# EAGLE design BridgerSoc (EAGLE 6.4)

## Sheet 1 of 4
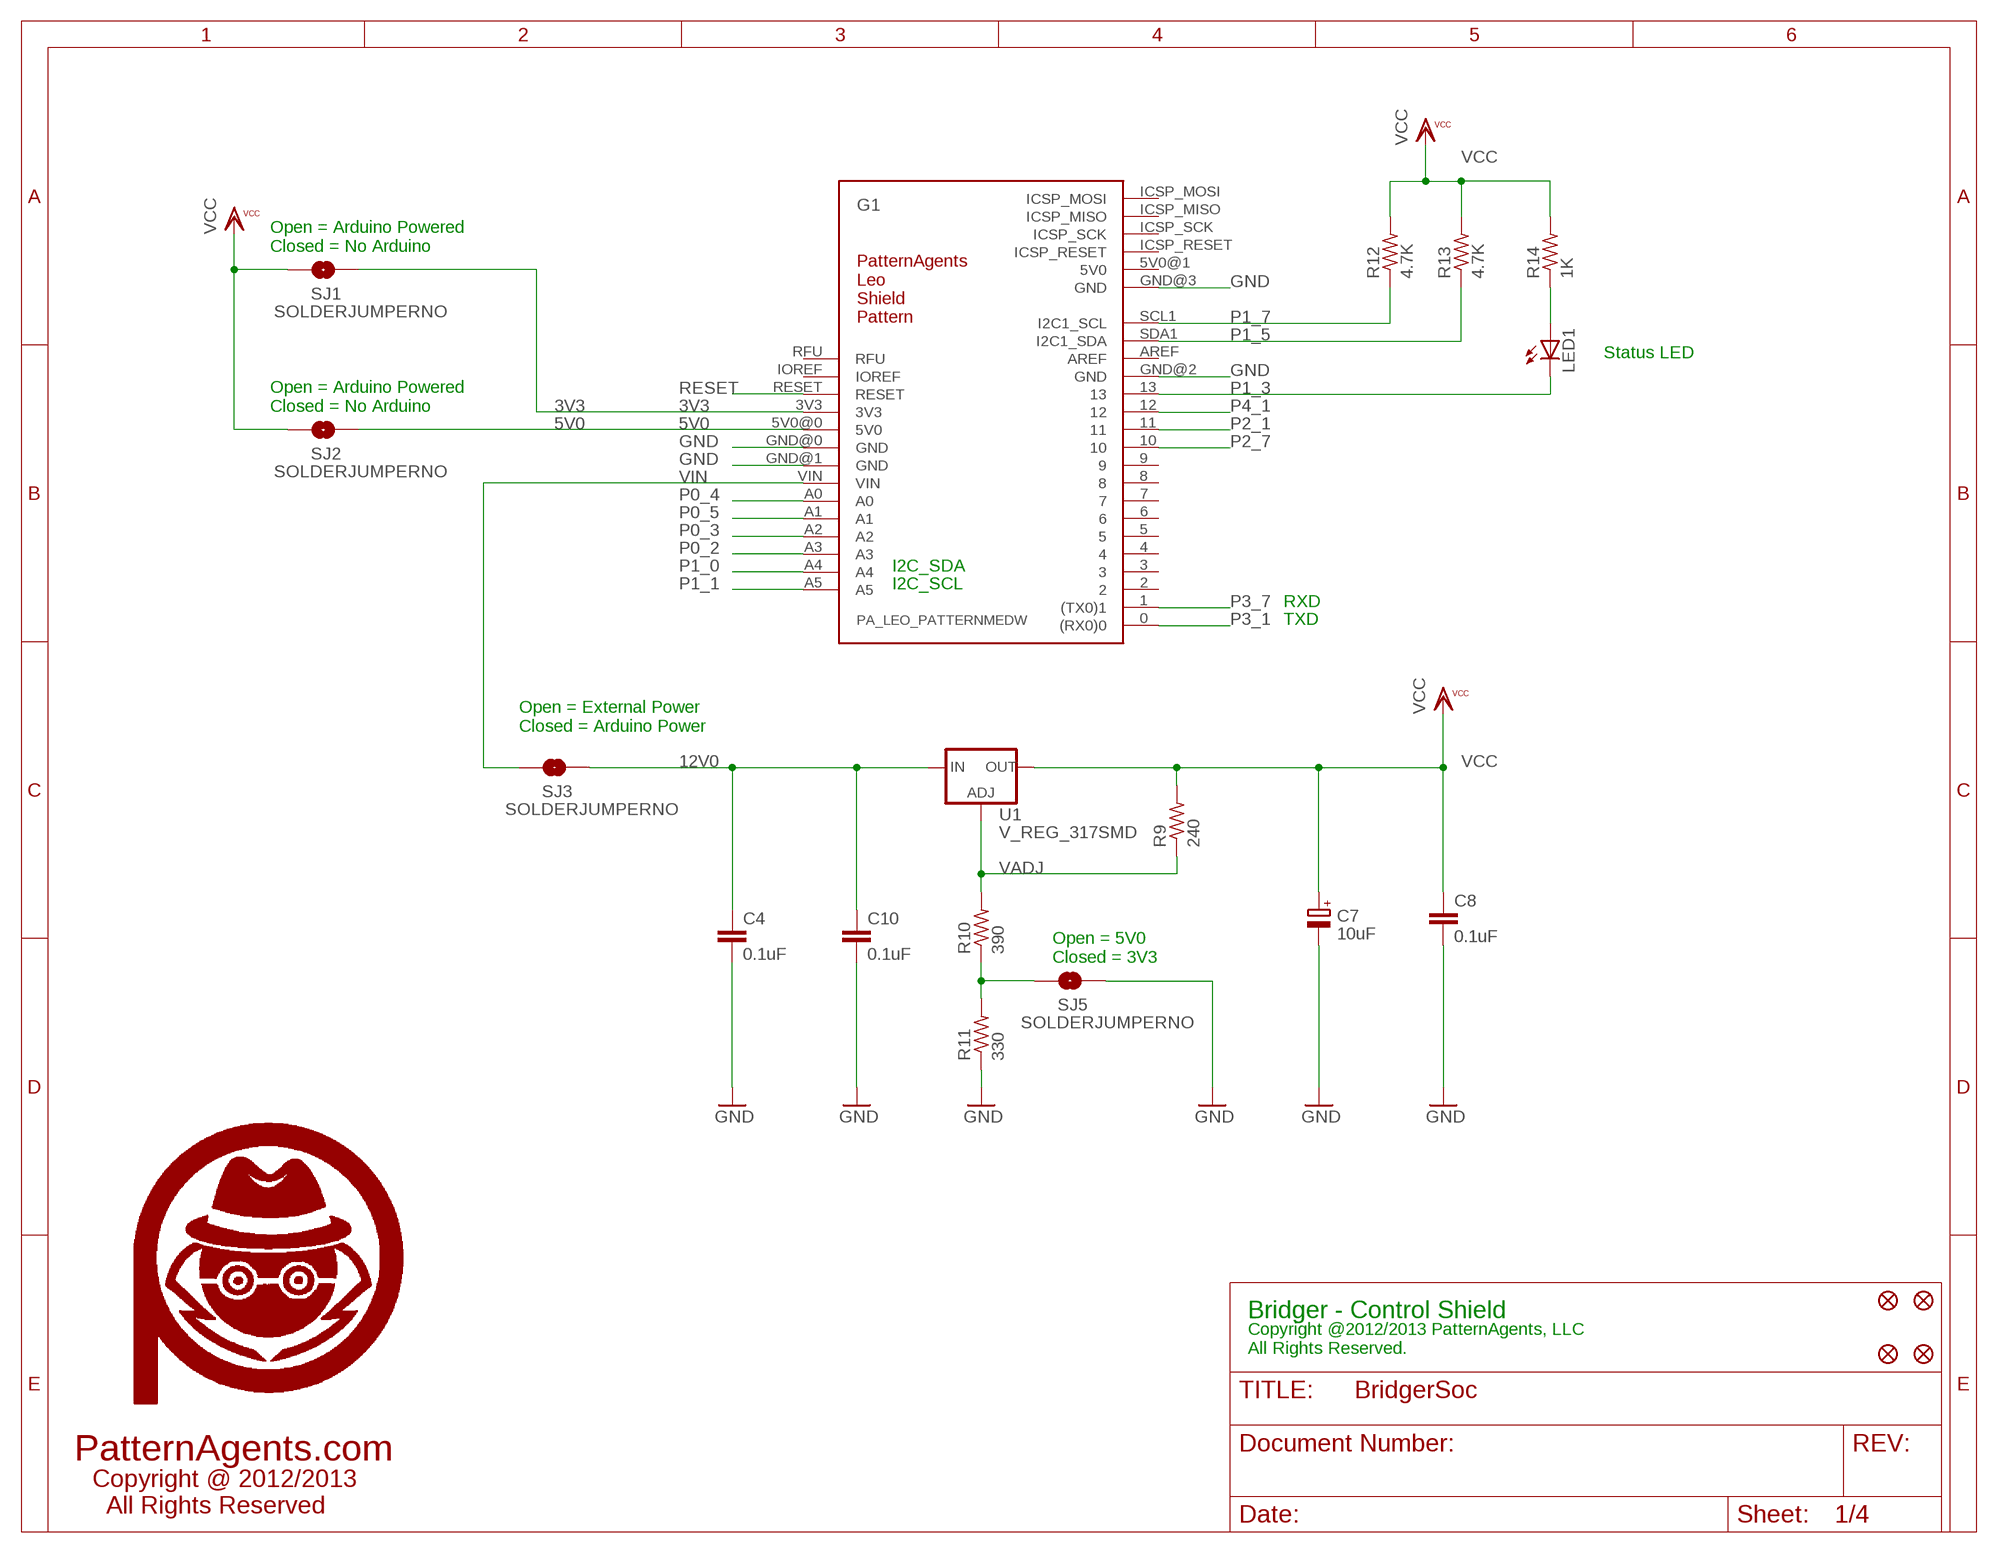
[diagram p0: schematic, sheet 1]

### Parts
C4  0.1uF  CAP0603-CAP  [0603-CAP]
C7  10uF  CPOL-EUSMCB  [SMC_B]
C8  0.1uF  CAP0603-CAP  [0603-CAP]
C10  0.1uF  CAP0603-CAP  [0603-CAP]
FID1  FIDUCIAL1.5X3  [FIDUCIAL-1.5X3]
FID2  FIDUCIAL1.5X3  [FIDUCIAL-1.5X3]
FID3  FIDUCIAL1.5X3  [FIDUCIAL-1.5X3]
FID4  FIDUCIAL1.5X3  [FIDUCIAL-1.5X3]
G1  PA_LEO_PATTERNMEDW  [PA_LEO_MEDW_PATTERN]
LED1  LED0603  [LED-0603]
R9  240  RESISTORR0603  [R0603]
R10  390  RESISTORR0603  [R0603]
R11  330  RESISTORR0603  [R0603]
R12  4.7K  RESISTORR0603  [R0603]
R13  4.7K  RESISTORR0603  [R0603]
R14  1K  RESISTORR0603  [R0603]
SJ1  SOLDERJUMPERNO  [SJ_2S-NO]
SJ2  SOLDERJUMPERNO  [SJ_2S-NO]
SJ3  SOLDERJUMPERNO  [SJ_2S-NO]
SJ5  SOLDERJUMPERNO  [SJ_2S-NO]
U1  V_REG_317SMD  [SOT223]
U$1  PA_LOGO_SYMLARGE  [PA_LOGO_AGENT_LRG_SYM]

### Nets
3V3: G1.3V3 SJ1.1
5V0: G1.5V0@0(5V0) SJ2.1
12V0: C4.1 C10.1 SJ3.1 U1.3(IN) ; also sheet 3
GND: C4.2 C7.- C8.2 C10.2 G1.GND@0(GND) G1.GND@1(GND) G1.GND@2(GND) G1.GND@3(GND) R11.1 SJ5.1 ; also sheet 2,3,4
LED_D13: LED1.A R14.1
P0_2: G1.A3 ; also sheet 2
P0_3: G1.A2 ; also sheet 2
P0_4: G1.A0 ; also sheet 2
P0_5: G1.A1 ; also sheet 2
P1_0: G1.A4 ; also sheet 2
P1_1: G1.A5 ; also sheet 2
P1_3: G1.13 LED1.C ; also sheet 2
P1_5: G1.SDA1(I2C1_SDA) R13.1 ; also sheet 2
P1_7: G1.SCL1(I2C1_SCL) R12.1 ; also sheet 2
P2_1: G1.11 ; also sheet 2
P2_7: G1.10 ; also sheet 2
P3_1: G1.0((RX0)0) ; also sheet 2
P3_7: G1.1((TX0)1) ; also sheet 2
P4_1: G1.12 ; also sheet 2
RESET: G1.RESET
V3_5: R10.1 R11.2 SJ5.2
VADJ: R9.1 R10.2 U1.1(ADJ)
VCC: C7.+ C8.1 R9.2 R12.2 R13.2 R14.2 SJ1.2 SJ2.2 U1.2(OUT) ; also sheet 2,3,4
VIN: G1.VIN SJ3.2
Unconnected: G1.2 G1.3 G1.4 G1.5 G1.6 G1.7 G1.8 G1.9 G1.AREF G1.ICSP_MISO G1.ICSP_MOSI G1.ICSP_RESET G1.ICSP_SCK G1.IOREF

### Notes on the sheet
- Open = Arduino Powered
  Closed = No Arduino
- Status LED
- Open = Arduino Powered
  Closed = No Arduino
- I2C_SDA
- I2C_SCL
- RXD
- TXD
- Open = External Power
  Closed = Arduino Power
- Open = 5V0
  Closed = 3V3
- Bridger - Control Shield
- Copyright @2012/2013 PatternAgents, LLC
  All Rights Reserved.
- PatternAgents.com
- Copyright @ 2012/2013
    All Rights Reserved

## Sheet 2 of 4
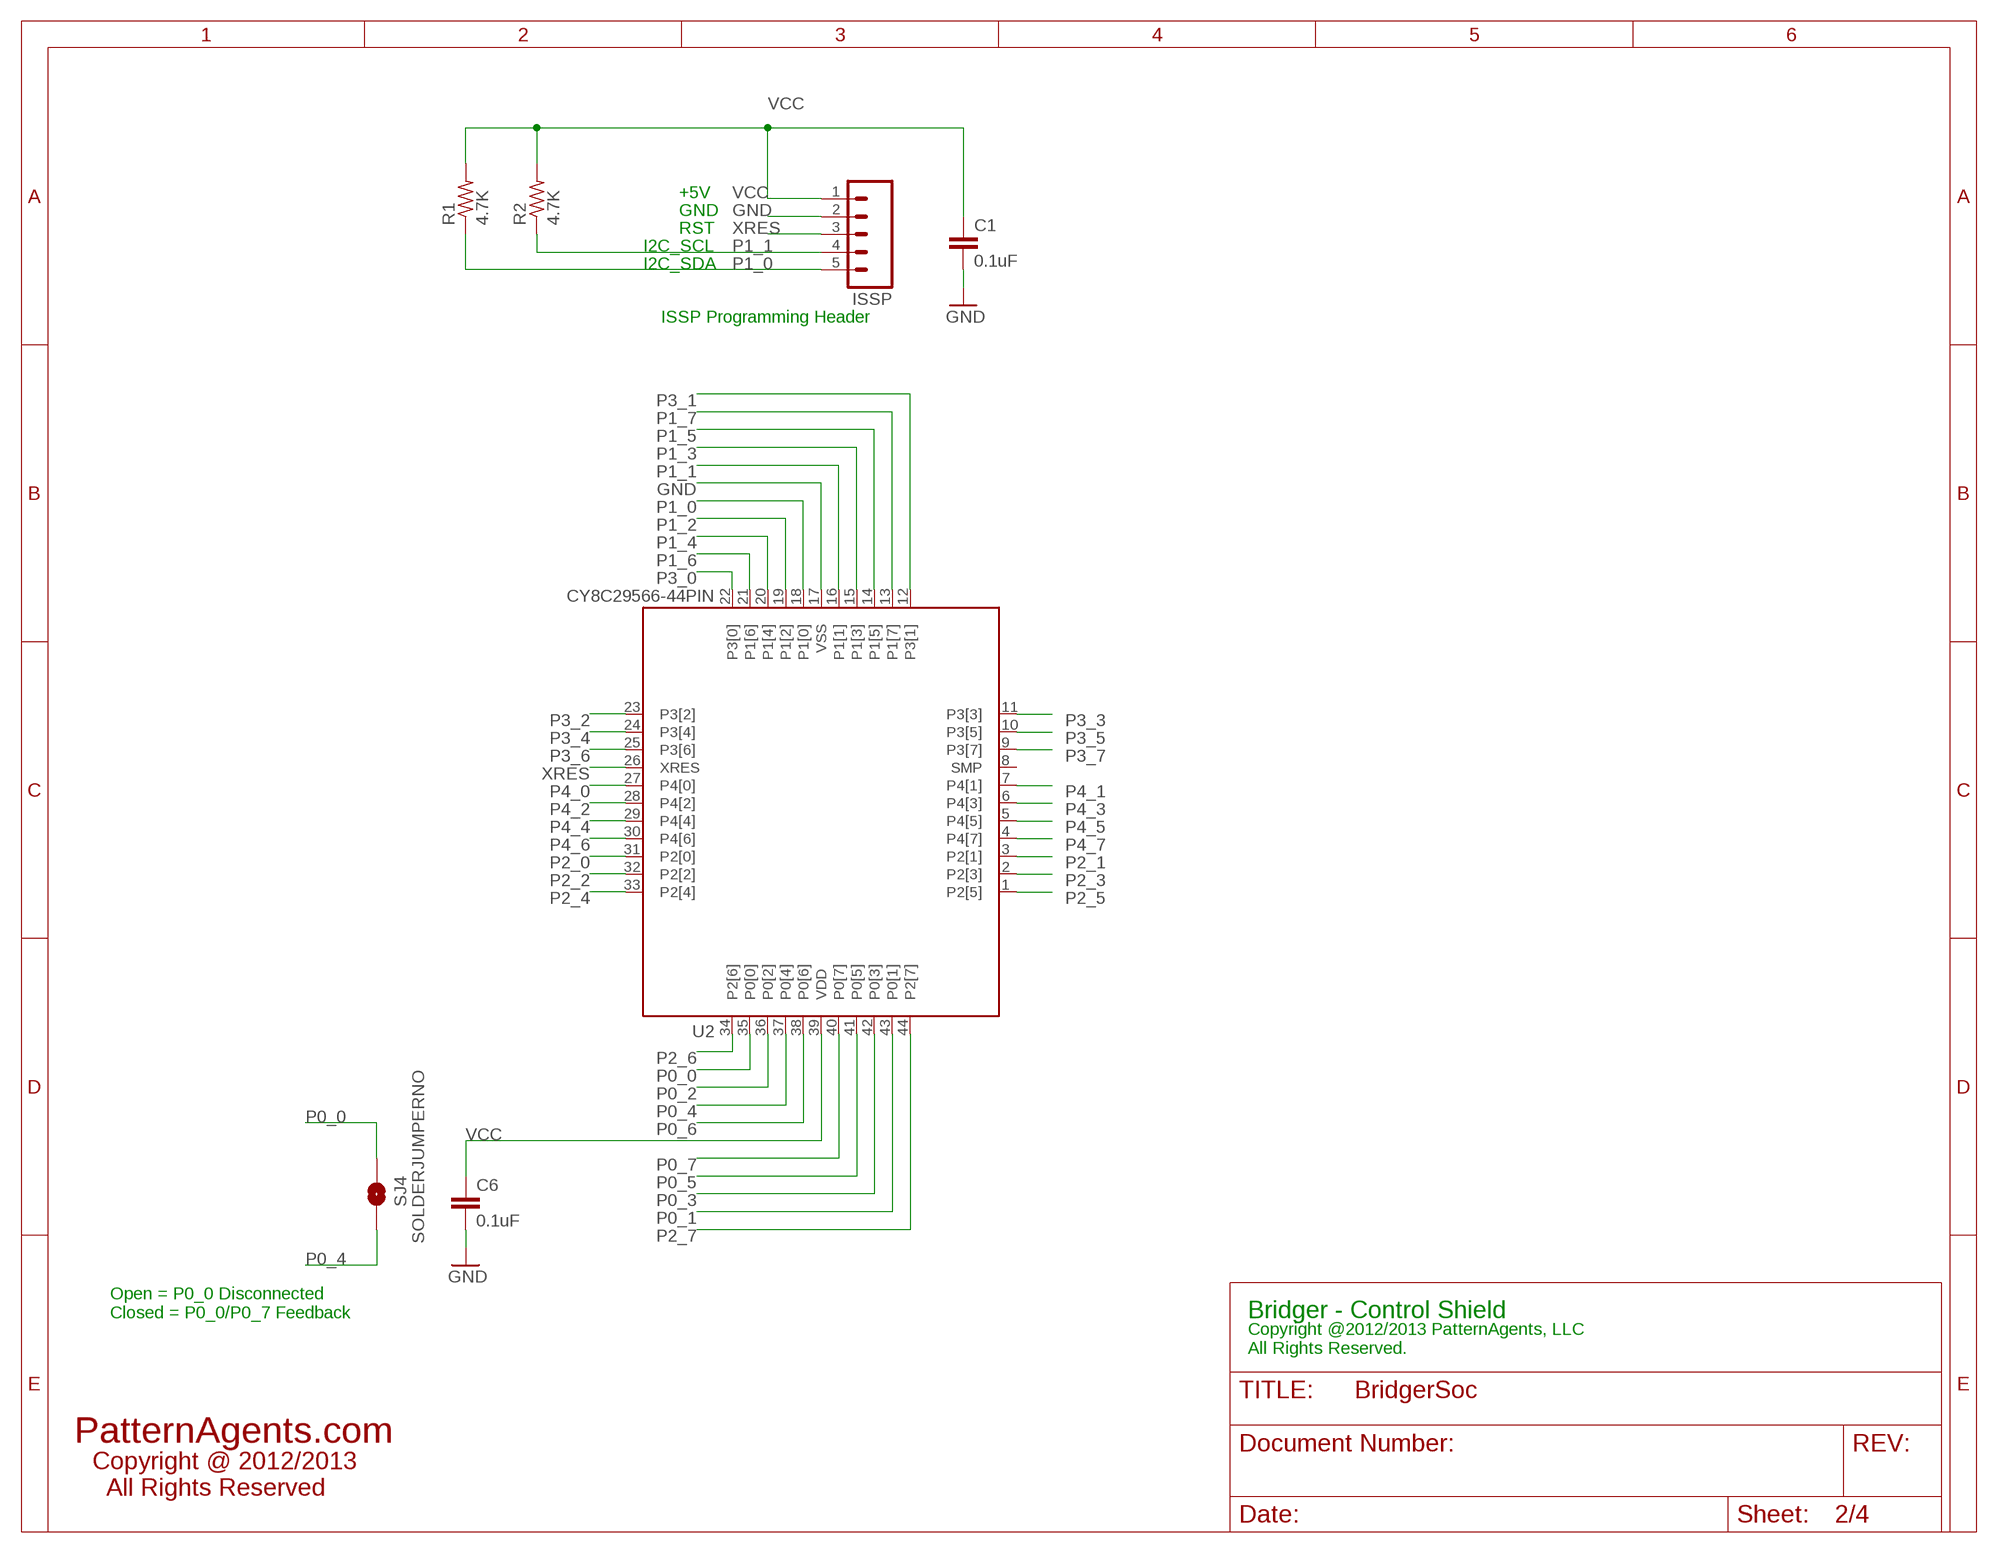
[diagram p1: schematic, sheet 2]

### Parts
C1  0.1uF  CAP0603-CAP  [0603-CAP]
C6  0.1uF  CAP0603-CAP  [0603-CAP]
ISSP  M05PTH  [1X05]
R1  4.7K  RESISTORR0603  [R0603]
R2  4.7K  RESISTORR0603  [R0603]
SJ4  SOLDERJUMPERNO  [SJ_2S-NO]
U2  CY8C29566-44PIN  [TQFP-10X10-44]

### Nets
GND: C1.2 C6.2 ISSP.2 U2.17(VSS) ; also sheet 1,3,4
P0_0: SJ4.1 U2.35(P0[0])
P0_1: U2.43(P0[1]) ; also sheet 3
P0_2: U2.36(P0[2]) ; also sheet 1
P0_3: U2.42(P0[3]) ; also sheet 1
P0_4: SJ4.2 U2.37(P0[4]) ; also sheet 1
P0_5: U2.41(P0[5]) ; also sheet 1
P0_6: U2.38(P0[6]) ; also sheet 3
P0_7: U2.40(P0[7]) ; also sheet 3
P1_0: ISSP.5 R1.1 U2.18(P1[0]) ; also sheet 1
P1_1: ISSP.4 R2.1 U2.16(P1[1]) ; also sheet 1
P1_2: U2.19(P1[2]) ; also sheet 3
P1_3: U2.15(P1[3]) ; also sheet 1
P1_4: U2.20(P1[4]) ; also sheet 3
P1_5: U2.14(P1[5]) ; also sheet 1
P1_6: U2.21(P1[6]) ; also sheet 3
P1_7: U2.13(P1[7]) ; also sheet 1
P2_0: U2.31(P2[0]) ; also sheet 3
P2_1: U2.3(P2[1]) ; also sheet 1
P2_2: U2.32(P2[2]) ; also sheet 3
P2_3: U2.2(P2[3]) ; also sheet 3
P2_4: U2.33(P2[4]) ; also sheet 3
P2_5: U2.1(P2[5]) ; also sheet 3
P2_6: U2.34(P2[6]) ; also sheet 4
P2_7: U2.44(P2[7]) ; also sheet 1
P3_0: U2.22(P3[0]) ; also sheet 3
P3_1: U2.12(P3[1]) ; also sheet 1
P3_2: U2.23(P3[2]) ; also sheet 4
P3_3: U2.11(P3[3]) ; also sheet 3
P3_4: U2.24(P3[4]) ; also sheet 4
P3_5: U2.10(P3[5]) ; also sheet 3
P3_6: U2.25(P3[6]) ; also sheet 3
P3_7: U2.9(P3[7]) ; also sheet 1
P4_0: U2.27(P4[0]) ; also sheet 3
P4_1: U2.7(P4[1]) ; also sheet 1
P4_2: U2.28(P4[2]) ; also sheet 3
P4_3: U2.6(P4[3]) ; also sheet 4
P4_4: U2.29(P4[4]) ; also sheet 3
P4_5: U2.5(P4[5]) ; also sheet 4
P4_6: U2.30(P4[6]) ; also sheet 3
P4_7: U2.4(P4[7]) ; also sheet 4
VCC: C1.1 C6.1 ISSP.1 R1.2 R2.2 U2.39(VDD) ; also sheet 1,3,4
XRES: ISSP.3 U2.26(XRES)

### Notes on the sheet
- +5V
- GND
- RST
- I2C_SCL
- I2C_SDA
- ISSP Programming Header
- Open = P0_0 Disconnected
  Closed = P0_0/P0_7 Feedback
- Bridger - Control Shield
- Copyright @2012/2013 PatternAgents, LLC
  All Rights Reserved.
- PatternAgents.com
- Copyright @ 2012/2013
    All Rights Reserved

## Sheet 3 of 4
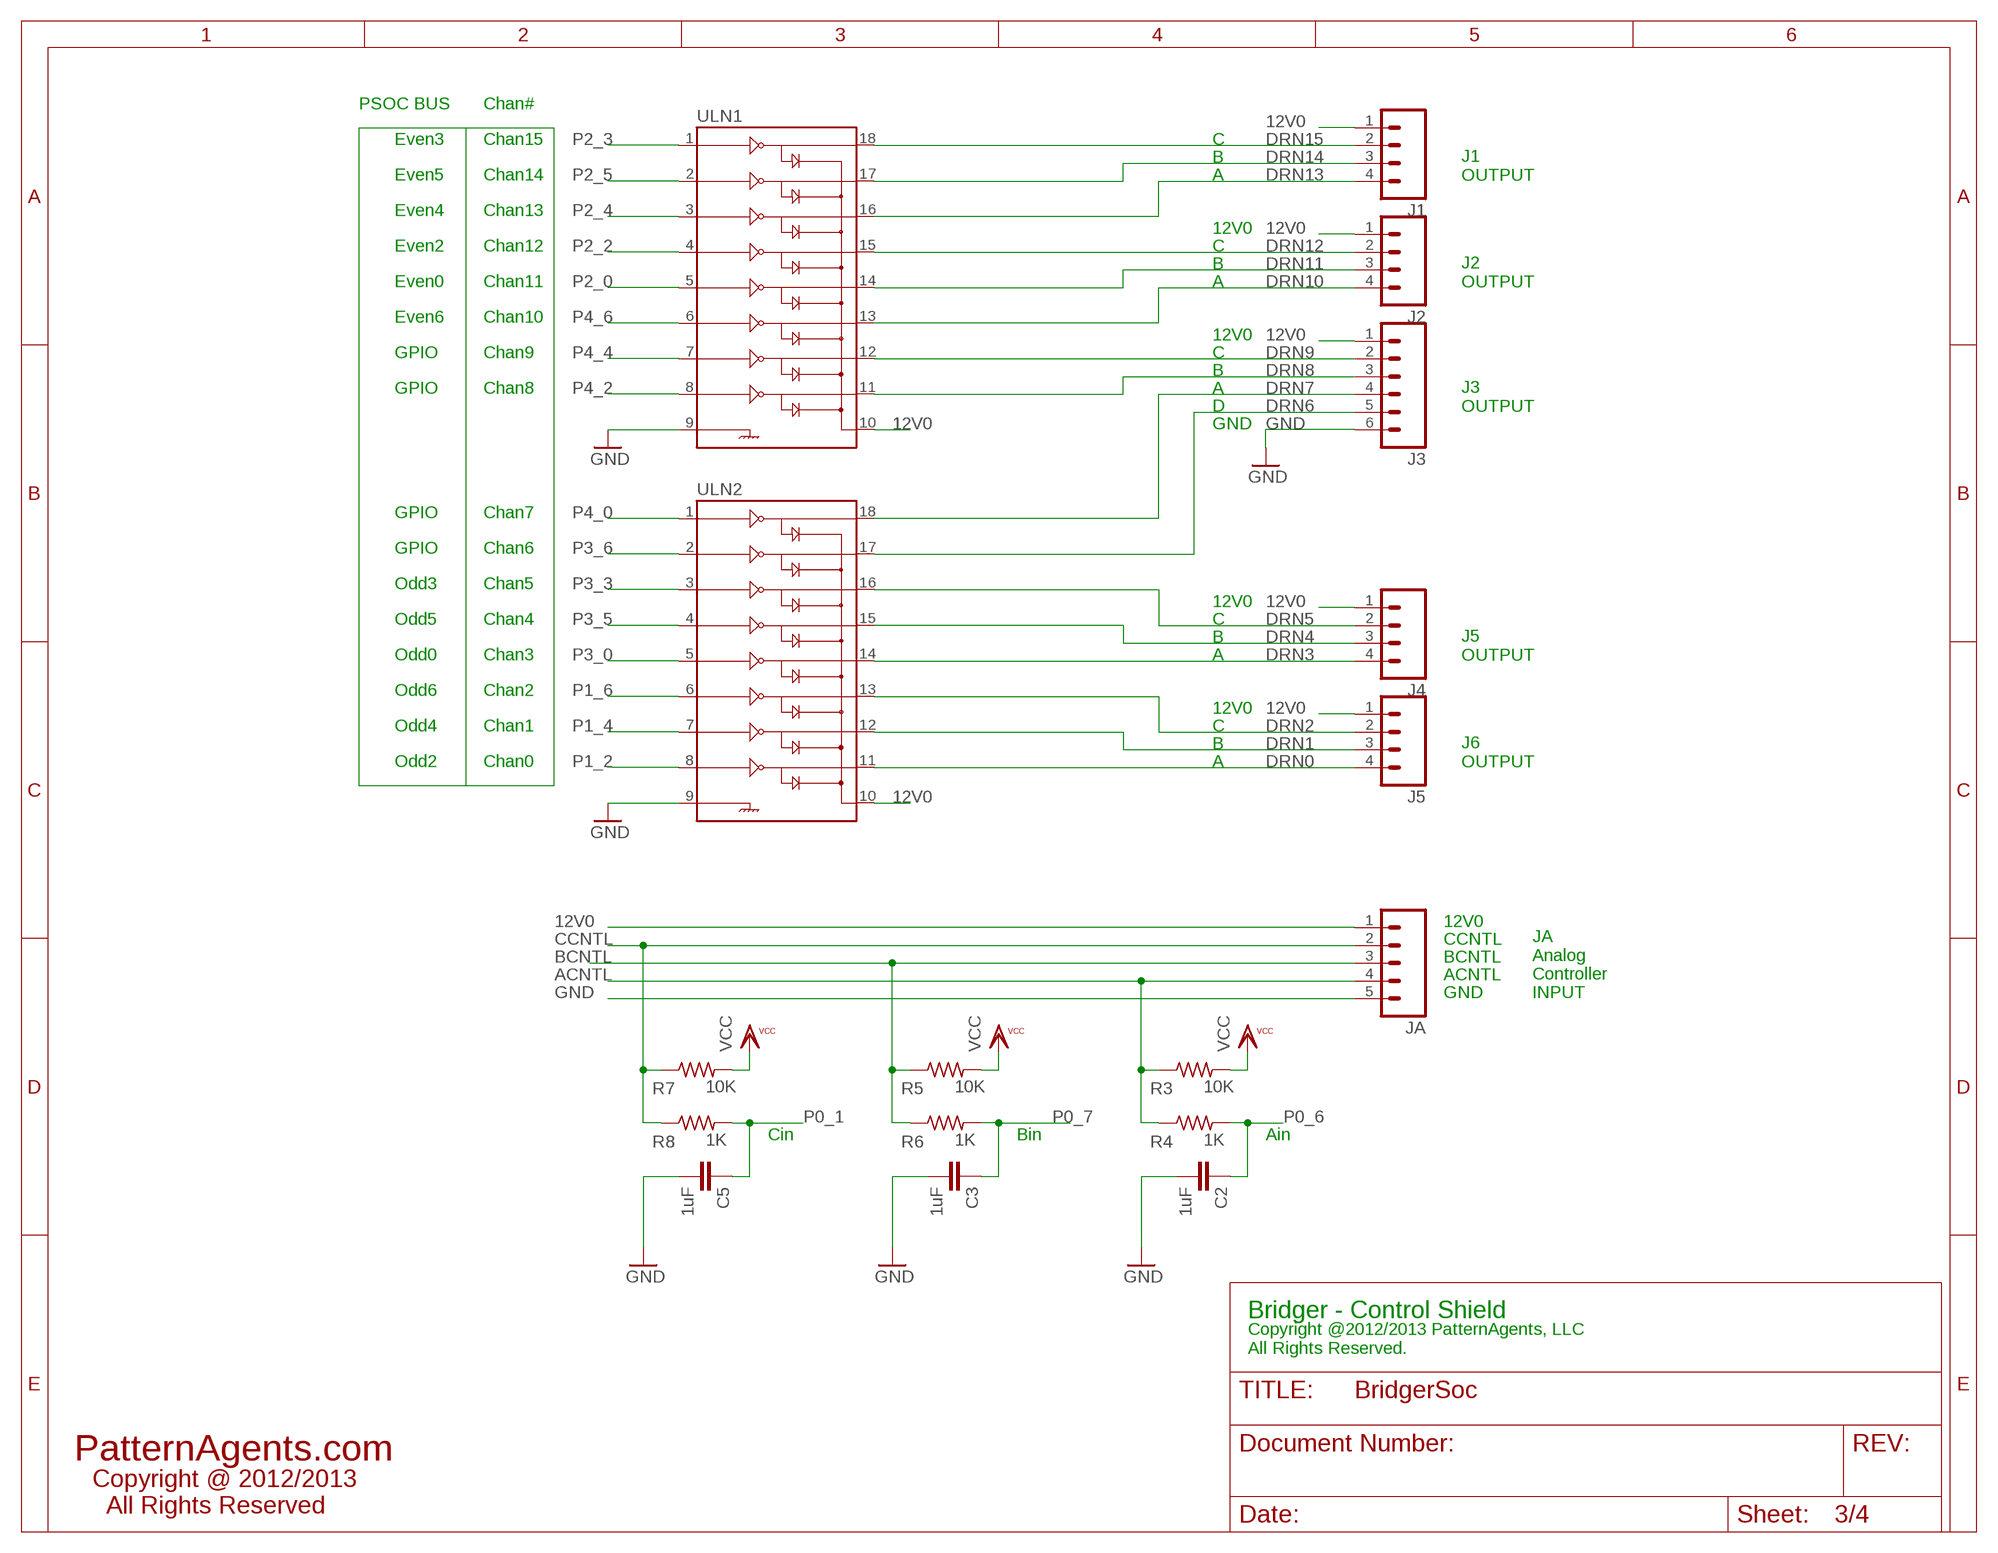
[diagram p2: schematic, sheet 3]

### Parts
C2  1uF  CAP0603-CAP  [0603-CAP]
C3  1uF  CAP0603-CAP  [0603-CAP]
C5  1uF  CAP0603-CAP  [0603-CAP]
J1  M04PTH  [1X04]
J2  M04PTH  [1X04]
J3  M06SIP  [1X06]
J4  M04PTH  [1X04]
J5  M04PTH  [1X04]
JA  M05PTH  [1X05]
R3  10K  RESISTORR0603  [R0603]
R4  1K  RESISTORR0603  [R0603]
R5  10K  RESISTORR0603  [R0603]
R6  1K  RESISTORR0603  [R0603]
R7  10K  RESISTORR0603  [R0603]
R8  1K  RESISTORR0603  [R0603]
ULN1  ULN2803SOICW  [SO18L]
ULN2  ULN2803SOICW  [SO18L]

### Nets
12V0: J1.1 J2.1 J3.1 J4.1 J5.1 JA.1 ULN1.10 ULN2.10 ; also sheet 1
ACNTL: JA.4 R3.1 R4.1
BCNTL: JA.3 R5.1 R6.1
CCNTL: JA.2 R7.1 R8.1
DRN0: J5.4 ULN2.11
DRN1: J5.3 ULN2.12
DRN2: J5.2 ULN2.13
DRN3: J4.4 ULN2.14
DRN4: J4.3 ULN2.15
DRN5: J4.2 ULN2.16
DRN6: J3.5 ULN2.17
DRN7: J3.4 ULN2.18
DRN8: J3.3 ULN1.11
DRN9: J3.2 ULN1.12
DRN10: J2.4 ULN1.13
DRN11: J2.3 ULN1.14
DRN12: J2.2 ULN1.15
DRN13: J1.4 ULN1.16
DRN14: J1.3 ULN1.17
DRN15: J1.2 ULN1.18
GND: C2.2 C3.2 C5.2 J3.6 JA.5 ULN1.9 ULN2.9 ; also sheet 1,2,4
P0_1: C5.1 R8.2 ; also sheet 2
P0_6: C2.1 R4.2 ; also sheet 2
P0_7: C3.1 R6.2 ; also sheet 2
P1_2: ULN2.8 ; also sheet 2
P1_4: ULN2.7 ; also sheet 2
P1_6: ULN2.6 ; also sheet 2
P2_0: ULN1.5 ; also sheet 2
P2_2: ULN1.4 ; also sheet 2
P2_3: ULN1.1 ; also sheet 2
P2_4: ULN1.3 ; also sheet 2
P2_5: ULN1.2 ; also sheet 2
P3_0: ULN2.5 ; also sheet 2
P3_3: ULN2.3 ; also sheet 2
P3_5: ULN2.4 ; also sheet 2
P3_6: ULN2.2 ; also sheet 2
P4_0: ULN2.1 ; also sheet 2
P4_2: ULN1.8 ; also sheet 2
P4_4: ULN1.7 ; also sheet 2
P4_6: ULN1.6 ; also sheet 2
VCC: R3.2 R5.2 R7.2 ; also sheet 1,2,4

### Notes on the sheet
- PSOC BUS | Chan#
- Even3 | Chan15 | C
- B
- Even5 | Chan14 | A
- J1
  OUTPUT
- Even4 | Chan13
- 12V0
- Even2 | Chan12 | C
- B
- Even0 | Chan11 | A
- J2
  OUTPUT
- Even6 | Chan10
- 12V0
- GPIO | Chan9 | C
- B
- GPIO | Chan8 | A
- D
- J3
  OUTPUT
- GND
- GPIO | Chan7
- GPIO | Chan6
- Odd3 | Chan5
- 12V0
- Odd5 | Chan4 | C
- B
- Odd0 | Chan3 | A
- J5
  OUTPUT
- Odd6 | Chan2
- 12V0
- Odd4 | Chan1 | C
- B
- Odd2 | Chan0 | A
- J6
  OUTPUT
- 12V0
- CCNTL
- BCNTL
- ACNTL
- GND
- JA
  Analog
  Controller
  INPUT
- Cin | Bin | Ain
- Bridger - Control Shield
- Copyright @2012/2013 PatternAgents, LLC
  All Rights Reserved.
- PatternAgents.com
- Copyright @ 2012/2013
    All Rights Reserved

## Sheet 4 of 4
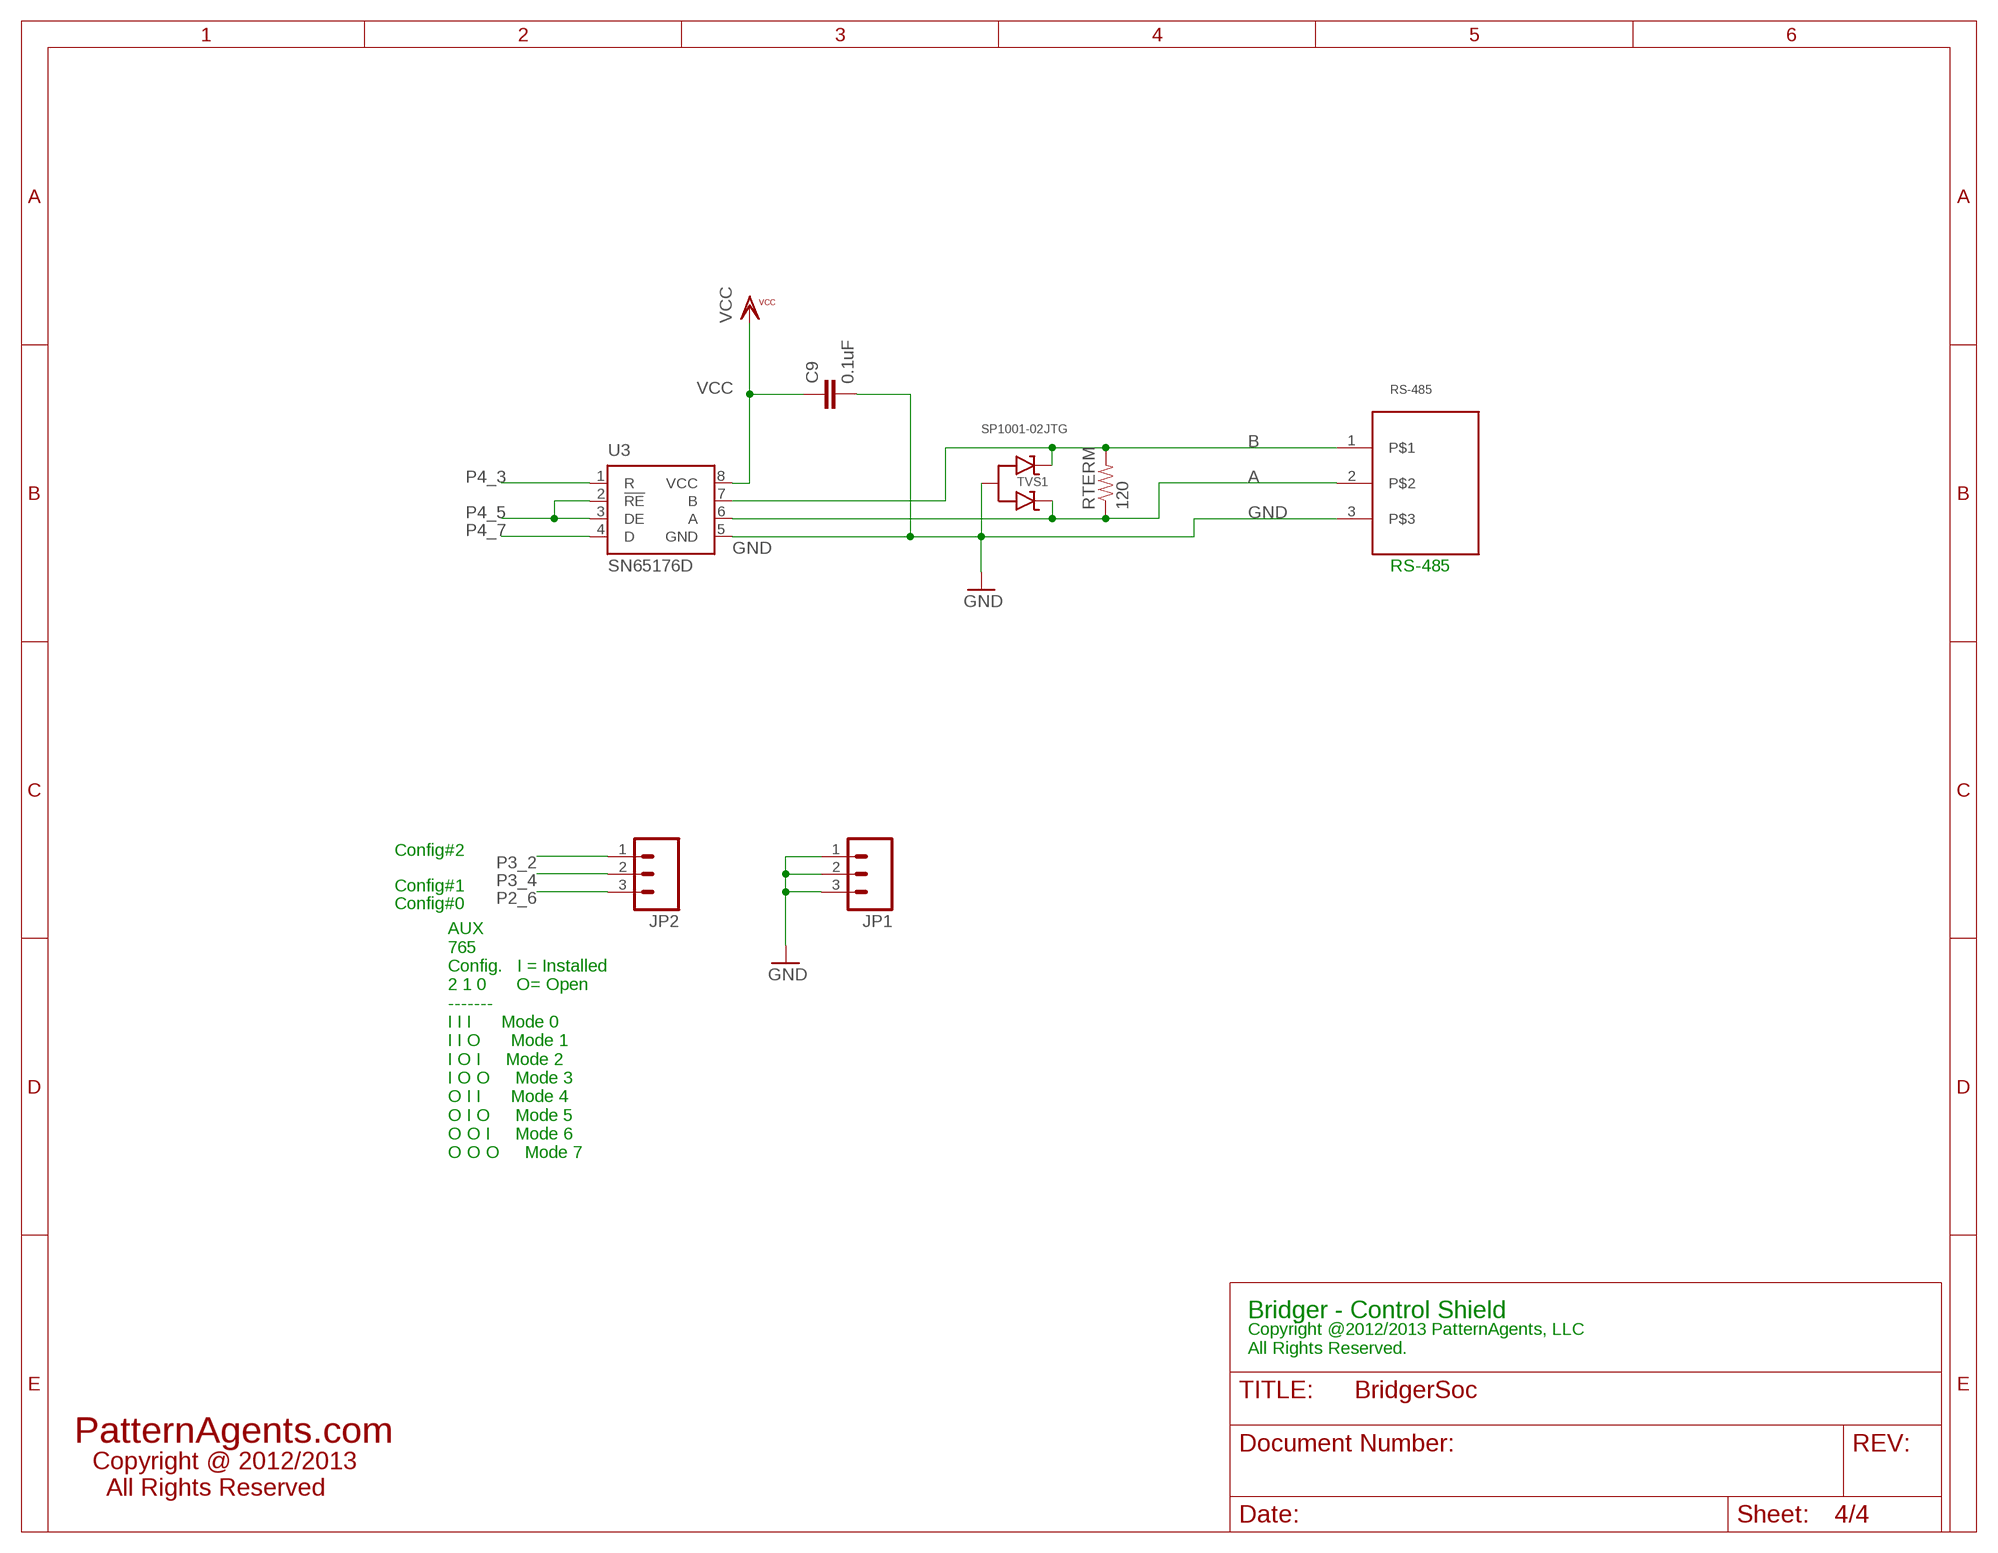
[diagram p3: schematic, sheet 4]

### Parts
C9  0.1uF  CAP0603-CAP  [0603-CAP]
JP1  M03PTH  [1X03]
JP2  M03PTH  [1X03]
RS-485  70553-02  [70553-02]
RTERM  120  RESISTOR_SFE0603-RES  [0603-RES]
TVS1  SP1001-02JTG  [SC70-3]
U3  SN65176D  [SO-08]

### Nets
A: RS-485.2 RTERM.1 TVS1.2(C2) U3.6(A)
B: RS-485.1 RTERM.2 TVS1.1(C1) U3.7(B)
GND: C9.2 JP1.1 JP1.2 JP1.3 RS-485.3 TVS1.3(A) U3.5(GND) ; also sheet 1,2,3
P2_6: JP2.3 ; also sheet 2
P3_2: JP2.1 ; also sheet 2
P3_4: JP2.2 ; also sheet 2
P4_3: U3.1(R) ; also sheet 2
P4_5: U3.2(!RE) U3.3(DE) ; also sheet 2
P4_7: U3.4(D) ; also sheet 2
VCC: C9.1 U3.8(VCC) ; also sheet 1,2,3

### Notes on the sheet
- RS-485
- Config#2
- Config#1
- Config#0
- AUX
  765
  Config.   I = Installed
  2 1 0      O= Open
  -------
  I I I      Mode 0
  I I O      Mode 1
  I O I     Mode 2
  I O O     Mode 3
  O I I      Mode 4
  O I O     Mode 5
  O O I     Mode 6
  O O O     Mode 7
- Bridger - Control Shield
- Copyright @2012/2013 PatternAgents, LLC
  All Rights Reserved.
- PatternAgents.com
- Copyright @ 2012/2013
    All Rights Reserved

## Power pins joined to a net without a drawn wire
5V0: G1.5V0@1(5V0)
RFU: G1.RFU
SMP: U2.8(SMP)

## Library data of the parts
C1 C6 = SparkFun:CAP: Capacitor Standard 0603 ceramic capacitor, and 0.1" leaded capacitor.
C2-C5 C8 C10 = PatternAgents-Misc:CAP: Capacitor Standard 0603 ceramic capacitor, and 0.1" leaded capacitor.
C7 = rcl:CPOL-EU: POLARIZED CAPACITOR, European symbol
C9 = moxdes_std:CAP: Capacitor Standard 0603 ceramic capacitor, and 0.1" leaded capacitor.
FID1-FID4 = PatternAgents-Misc:FIDUCIAL: Fiducial Alignment Points Various fiducial points for machine vision alignment.
G1 = PatternAgents-Boards:PA_LEO_PATTERN: PatternAgents Leo Shield Pattern Source LBR : http://www.patternagents.com Github : https://github.com/patternagents License : http://creativecommons.org/licenses/by-sa/2.5/ (Creative Commons 2.5) THIS SOFTWARE IS PROVIDED BY THE CONTRIBUTORS "AS IS" AND WITHOUT ANY EXPRESS OR IMPLIED WARRANTIES, INCLUDING, BUT NOT LIMITED TO, THE IMPLIED WARRANTIES OF MERCHANTABILITY AND FITNESS FOR A PARTICULAR PURPOSE ARE DISCLAIMED. IN NO EVENT SHALL THE COPYRIGHT OWNER OR CONTRIBUTORS BE LIABLE FOR ANY DIRECT, INDIRECT, INCIDENTAL, SPECIAL, EXEMPLARY, OR CONSEQUENTIAL DAMAGES (INCLUDING, BUT NOT LIMITED TO, PROCUREMENT OF SUBSTITUTE GOODS OR SERVICES; LOSS OF USE, DATA, OR PROFITS; OR BUSINESS INTERRUPTION) HOWEVER CAUSED AND ON ANY THEORY OF LIABILITY, WHETHER IN CONTRACT, STRICT LIABILITY, OR TORT (INCLUDING NEGLIGENCE OR OTHERWISE) ARISING IN ANY WAY OUT OF THE USE OF THIS SOFTWARE, EVEN IF ADVISED OF THE POSSIBILITY OF SUCH DAMAGE.
ISSP = SparkFun:M05: Header 5 Standard 5-pin 0.1" header. Use with straight break away headers (SKU : PRT-00116), right angle break away headers (PRT-00553), swiss pins (PRT-00743), machine pins (PRT-00117), and female headers (PRT-00115). Molex polarized connector foot print use with SKU : PRT-08230 with associated crimp pins and housings.
J1 J2 J4 J5 = PatternAgents-Misc:M04: Header 4 Standard 4-pin 0.1" header. Use with straight break away headers (SKU : PRT-00116), right angle break away headers (PRT-00553), swiss pins (PRT-00743), machine pins (PRT-00117), and female headers (PRT-00115). Molex polarized connector foot print use with SKU : PRT-08231 with associated crimp pins and housings. 1MM SMD Version SKU: PRT-10208
J3 = PatternAgents-Misc:M06: Header 6 Standard 6-pin 0.1" header. Use with straight break away headers (SKU : PRT-00116), right angle break away headers (PRT-00553), swiss pins (PRT-00743), machine pins (PRT-00117), and female headers (PRT-00115). Molex polarized connector foot print use with SKU : PRT-08094 with associated crimp pins and housings. NOTES ON THE VARIANTS LOCK and LOCK_LONGPADS... This footprint was designed to help hold the alignment of a through-hole component (i.e. 6-pin header) while soldering it into place. You may notice that each hole has been shifted either up or down by 0.005 of an inch from it's more standard position (which is a perfectly straight line). This slight alteration caused the pins (the squares in the middle) to touch the edges of the holes. Because they are alternating, it causes a "brace" to hold the component in place. 0.005 has proven to be the perfect amount of "off-center" position when using our standard breakaway headers. Although looks a little odd when you look at the bare footprint, once you have a header in there, the alteration is very hard to notice. Also, if you push a header all the way into place, it is covered up entirely on the bottom side. This idea of altering the position of holes to aid alignment will be further integrated into the Sparkfun Library for other footprints. It can help hold any component with 3 or more connection pins.
JA = PatternAgents-Misc:M05: Header 5 Standard 5-pin 0.1" header. Use with straight break away headers (SKU : PRT-00116), right angle break away headers (PRT-00553), swiss pins (PRT-00743), machine pins (PRT-00117), and female headers (PRT-00115). Molex polarized connector foot print use with SKU : PRT-08230 with associated crimp pins and housings.
JP1 JP2 = SparkFun-Connectors:M03: Header 3 Standard 3-pin 0.1" header. Use with straight break away headers (SKU : PRT-00116), right angle break away headers (PRT-00553), swiss pins (PRT-00743), machine pins (PRT-00117), and female headers (PRT-00115). Molex polarized connector foot print use with SKU : PRT-08232 with associated crimp pins and housings.
LED1 = SparkFun-LED:LED: LEDs Standard schematic elements and footprints for 5mm, 3mm, 1206, and 0603 sized LEDs. 5mm - Spark Fun Electronics SKU : COM-00529 (and others)
R1-R14 = PatternAgents-Misc:RESISTOR: RESISTOR, American symbol
RS-485 = PatternAgents-Molex:70553-02: Molex SL Modular Connectors - 3 PIN Data Source : http://www.molex.com/molex/products/datasheet.jsp?part=active/0705530003_PCB_HEADERS.xml LBR Source: http://www.patternagents.com THIS SOFTWARE IS PROVIDED BY THE CONTRIBUTORS "AS IS" AND WITHOUT ANY EXPRESS OR IMPLIED WARRANTIES, INCLUDING, BUT NOT LIMITED TO, THE IMPLIED WARRANTIES OF MERCHANTABILITY AND FITNESS FOR A PARTICULAR PURPOSE ARE DISCLAIMED. IN NO EVENT SHALL THE COPYRIGHT OWNER OR CONTRIBUTORS BE LIABLE FOR ANY DIRECT, INDIRECT, INCIDENTAL, SPECIAL, EXEMPLARY, OR CONSEQUENTIAL DAMAGES (INCLUDING, BUT NOT LIMITED TO, PROCUREMENT OF SUBSTITUTE GOODS OR SERVICES; LOSS OF USE, DATA, OR PROFITS; OR BUSINESS INTERRUPTION) HOWEVER CAUSED AND ON ANY THEORY OF LIABILITY, WHETHER IN CONTRACT, STRICT LIABILITY, OR TORT (INCLUDING NEGLIGENCE OR OTHERWISE) ARISING IN ANY WAY OUT OF THE USE OF THIS SOFTWARE, EVEN IF ADVISED OF THE POSSIBILITY OF SUCH DAMAGE.
RTERM = moxdes_std:RESISTOR_SFE: Resistor Basic schematic elements and footprints for 0603, 1206, and PTH resistors.
SJ1-SJ5 = SparkFun-Passives:SOLDERJUMPER: Solder Jumper Standard SMD solder jumper. Used to automate production. Two varients : Normally Open and Normally Closed are the same, but have different paste layers. NC will have a large amount of paste and should jumper during reflow.
TVS1 = moxdes_std:SP1001-02JTG: Littelfuse SP1001-02JTG TVS Diode Array 8pf 15kV Source: http://www.littelfuse.com/data/en/Product_Catalogs/Littelfuse_TVS_Diode_Array_SPA_Catalog.pdf patternshed.com: created 3/25/2012
U1 = SparkFun-PowerIC:V_REG_317: Voltage Regulator Standard LM317 adjustable voltage regulator. AOI (Adjust Output Input). Google 'LM317 Calculator' for easy to use app to get the two resistor values needed. 240/720 for 5V output. 240/390 for 3.3V output. Spark Fun Electronics SKU : COM-00527
U2 = PatternAgents-Cypress:CY8C29566-44PIN: Cypress PSoC® 1 - Programmable System on Chip, M8C Based Source Data: http://www.cypress.com/?mpn=CY8C29566 LBR Source: http://www.patternagents.com THIS SOFTWARE IS PROVIDED BY THE CONTRIBUTORS "AS IS" AND WITHOUT ANY EXPRESS OR IMPLIED WARRANTIES, INCLUDING, BUT NOT LIMITED TO, THE IMPLIED WARRANTIES OF MERCHANTABILITY AND FITNESS FOR A PARTICULAR PURPOSE ARE DISCLAIMED. IN NO EVENT SHALL THE COPYRIGHT OWNER OR CONTRIBUTORS BE LIABLE FOR ANY DIRECT, INDIRECT, INCIDENTAL, SPECIAL, EXEMPLARY, OR CONSEQUENTIAL DAMAGES (INCLUDING, BUT NOT LIMITED TO, PROCUREMENT OF SUBSTITUTE GOODS OR SERVICES; LOSS OF USE, DATA, OR PROFITS; OR BUSINESS INTERRUPTION) HOWEVER CAUSED AND ON ANY THEORY OF LIABILITY, WHETHER IN CONTRACT, STRICT LIABILITY, OR TORT (INCLUDING NEGLIGENCE OR OTHERWISE) ARISING IN ANY WAY OUT OF THE USE OF THIS SOFTWARE, EVEN IF ADVISED OF THE POSSIBILITY OF SUCH DAMAGE.
U3 = moxdes_std:SN65176: DIFFERENTIAL BUS TRANSCEIVER Source: http://focus.ti.com .. sn65176b.pdf; MF: TEXAS INSTRUMENTS; MPN: SN65176BD; OC_FARNELL: 9589970; OC_NEWARK: 08F5891
U$1 = PatternAgents-Logos:PA_LOGO_SYM: PatternAgents Logo Symbol Trademark : PatternAgents, LLC Github : https://github.com/PatternAgents/PCB_Libraries License : http://creativecommons.org/licenses/by-sa/3.0/ (Creative Commons 3.0) THIS SOFTWARE IS PROVIDED BY THE CONTRIBUTORS "AS IS" AND WITHOUT ANY EXPRESS OR IMPLIED WARRANTIES, INCLUDING, BUT NOT LIMITED TO, THE IMPLIED WARRANTIES OF MERCHANTABILITY AND FITNESS FOR A PARTICULAR PURPOSE ARE DISCLAIMED. IN NO EVENT SHALL THE COPYRIGHT OWNER OR CONTRIBUTORS BE LIABLE FOR ANY DIRECT, INDIRECT, INCIDENTAL, SPECIAL, EXEMPLARY, OR CONSEQUENTIAL DAMAGES (INCLUDING, BUT NOT LIMITED TO, PROCUREMENT OF SUBSTITUTE GOODS OR SERVICES; LOSS OF USE, DATA, OR PROFITS; OR BUSINESS INTERRUPTION) HOWEVER CAUSED AND ON ANY THEORY OF LIABILITY, WHETHER IN CONTRACT, STRICT LIABILITY, OR TORT (INCLUDING NEGLIGENCE OR OTHERWISE) ARISING IN ANY WAY OUT OF THE USE OF THIS SOFTWARE, EVEN IF ADVISED OF THE POSSIBILITY OF SUCH DAMAGE.
ULN1 ULN2 = SparkFun-PowerIC:ULN2803: Darlington Driver ULN2803 Darlington array. 500mA max per channel, 8-channel package. Spark Fun Electronics SKU : COM-00312

## Board
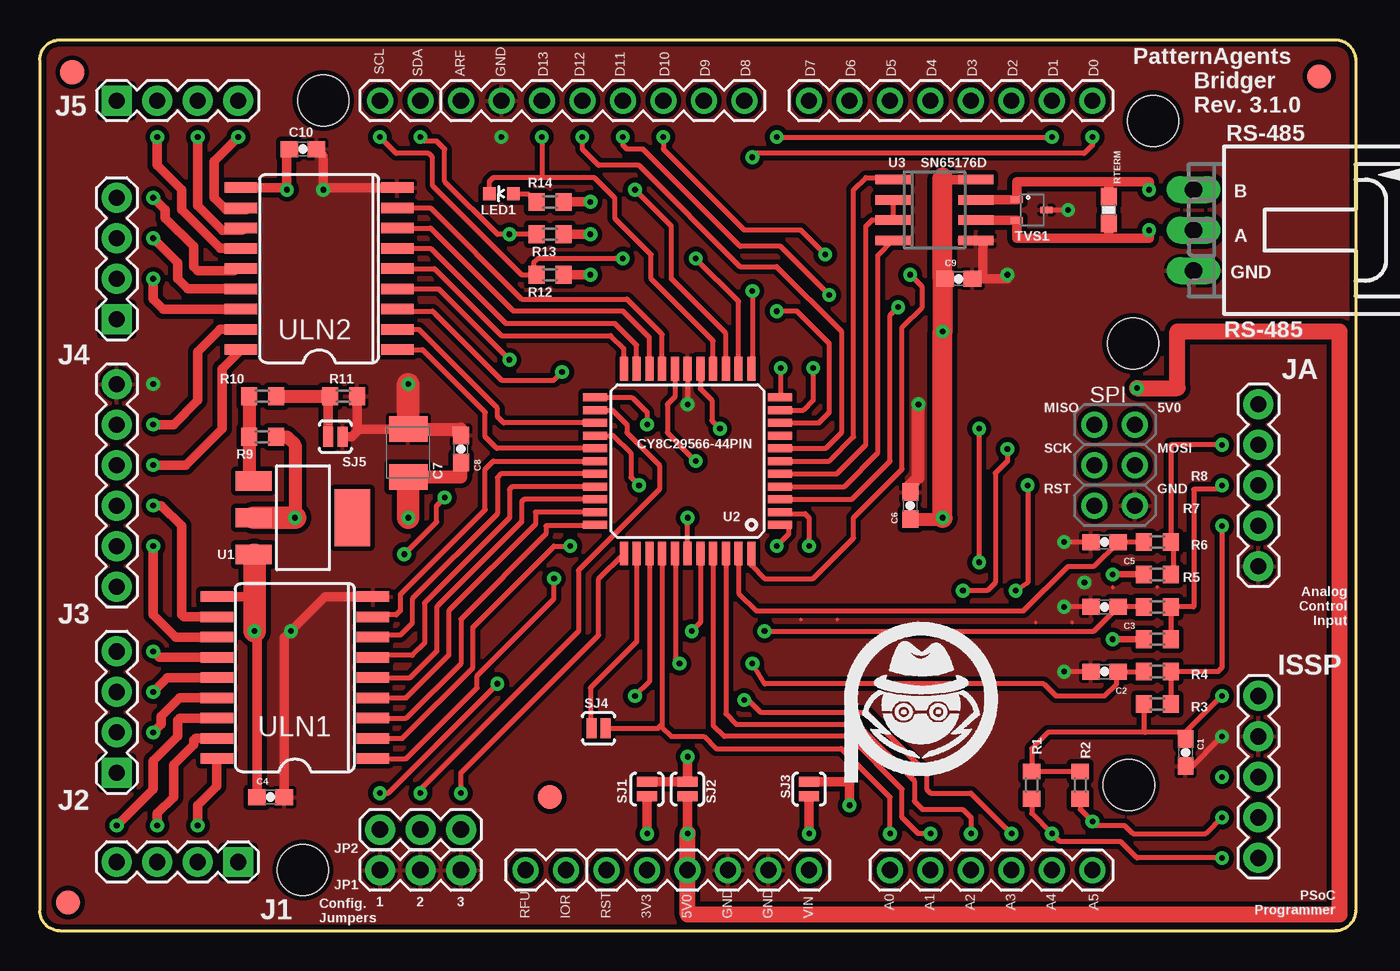
[diagram p4: board, top side]
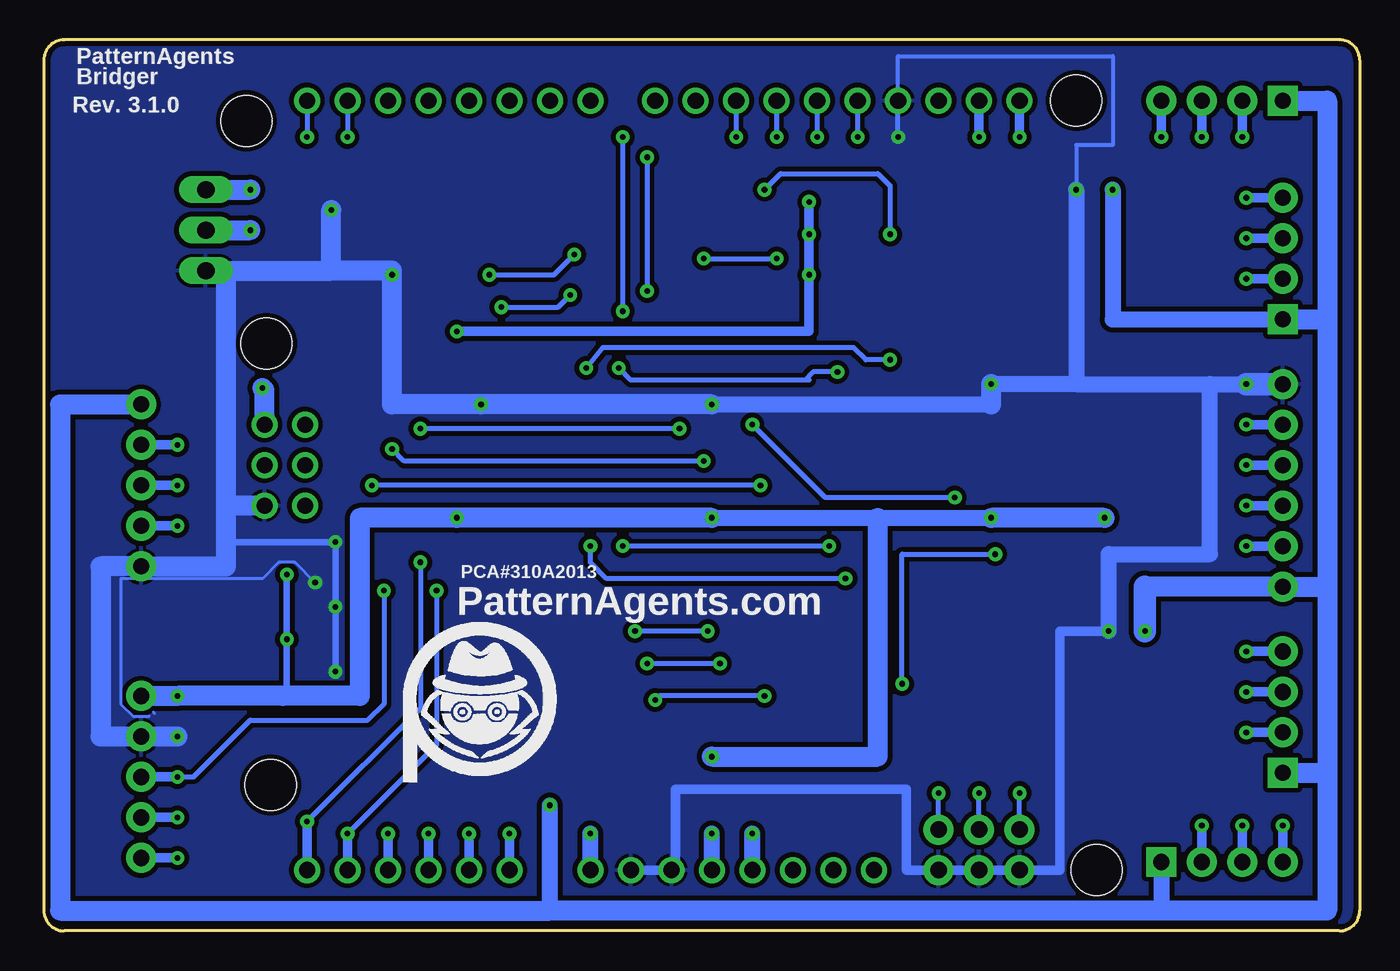
[diagram p5: board, bottom side, seen from below]

Size 82.55 x 55.88 mm. Coordinates in mm from the lower left corner, seen from the top.
Copper layers (1*16): Top 0.035mm / dielectric 1.5mm / Bottom 0.035mm
Design rules "PatternAgents": minimum track width 8mil, minimum drill 14mil, track to track 8mil, track to pad 8mil, pad to pad 8mil, via to via 8mil, smd to smd 8mil, copper to edge 10mil, drill to drill 8mil, minimum pad ring 12mil, minimum via ring 10mil, stop-mask expansion 4mil, vias tented up to drill 25mil, thermal gap 8mil

### Footprints (pad centres in the part's own frame; a part is rotated, then mirrored left to right if it is on the bottom)
0603-CAP = smd 1.1 x 1: 1 -0.85,0; 2 0.85,0
SMC_B = smd 1.6 x 2.4: + -1.5,0; - 1.5,0
FIDUCIAL-1.5X3 = smd 1.5 x 1.5: 1 0,0
PA_LEO_MEDW_PATTERN = drill 1.016: 0 66.04,52.07; 1 63.5,52.07; 2 60.96,52.07; 3 58.42,52.07; 3V3 38.1,3.81; 4 55.88,52.07; 5 53.34,52.07; 5V0@0 40.64,3.81; 5V0@1 68.707,31.75; 6 50.8,52.07; 7 48.26,52.07; 8 44.196,52.07; 9 41.656,52.07; 10 39.116,52.07; 11 36.576,52.07; 12 34.036,52.07; 13 31.496,52.07; A0 53.34,3.81; A1 55.88,3.81; A2 58.42,3.81; A3 60.96,3.81; A4 63.5,3.81; A5 66.04,3.81; AREF 26.416,52.07; GND@0 43.18,3.81; GND@1 45.72,3.81; GND@2 28.956,52.07; GND@3 68.707,26.67; ICSP_MISO 66.167,31.75; ICSP_MOSI 68.707,29.21; ICSP_RESET 66.167,26.67; ICSP_SCK 66.167,29.21; IOREF 33.02,3.81; RESET 35.56,3.81; RFU 30.48,3.81; SCL1 21.336,52.07; SDA1 23.876,52.07; VIN 48.26,3.81 | hole 3.2: 17.78,52.07; 16.51,3.81; 68.326,9.144; 68.58,36.83; 69.85,50.8
1X05 = drill 1.016 pad 1.88: 1 0,0; 2 2.54,0; 3 5.08,0; 4 7.62,0; 5 10.16,0
1X04 = drill 1.016 pad 1.88 square: 1 0,0 | drill 1.016 pad 1.88: 2 2.54,0; 3 5.08,0; 4 7.62,0
1X06 = drill 1.016 pad 1.88: 1 0,0; 2 2.54,0; 3 5.08,0; 4 7.62,0; 5 10.16,0; 6 12.7,0
1X03 = drill 1.016 pad 1.88: 1 0,0; 2 2.54,0; 3 5.08,0
LED-0603 = smd 0.8 x 0.8: A 0,-0.75; C 0,0.75
R0603 = smd 1 x 1.1: 1 -0.85,0; 2 0.85,0
70553-02 = drill 1.092 long: 1 -2.54,-7.62; 2 0,-7.62; 3 2.54,-7.62
0603-RES = smd 1.1 x 1: 1 -0.85,0; 2 0.85,0
SJ_2S-NO = smd 0.635 x 1.27: 1 -0.45,0; 2 0.45,0
SC70-3 = smd 0.4 x 0.75: 1 -0.65,-0.925; 2 0.65,-0.925; 3 0,0.925
SOT223 = smd 1.219 x 2.235: 1 -2.311,-3.099; 2 0,-3.099; 3 2.311,-3.099 | smd 3.6 x 2.2: 4 0,3.099
TQFP-10X10-44 = smd 1.5 x 0.5: 1 -5.8,4; 2 -5.8,3.2; 3 -5.8,2.4; 4 -5.8,1.6; 5 -5.8,0.8; 6 -5.8,0; 7 -5.8,-0.8; 8 -5.8,-1.6; 9 -5.8,-2.4; 10 -5.8,-3.2; 11 -5.8,-4; 23 5.8,-4; 24 5.8,-3.2; 25 5.8,-2.4; 26 5.8,-1.6; 27 5.8,-0.8; 28 5.8,0; 29 5.8,0.8; 30 5.8,1.6; 31 5.8,2.4; 32 5.8,3.2; 33 5.8,4 | smd 0.5 x 1.5: 12 -4,-5.8; 13 -3.2,-5.8; 14 -2.4,-5.8; 15 -1.6,-5.8; 16 -0.8,-5.8; 17 0,-5.8; 18 0.8,-5.8; 19 1.6,-5.8; 20 2.4,-5.8; 21 3.2,-5.8; 22 4,-5.8; 34 4,5.8; 35 3.2,5.8; 36 2.4,5.8; 37 1.6,5.8; 38 0.8,5.8; 39 0,5.8; 40 -0.8,5.8; 41 -1.6,5.8; 42 -2.4,5.8; 43 -3.2,5.8; 44 -4,5.8
SO-08 = smd 0.6 x 2.2: 1 -1.905,-2.6; 2 -0.635,-2.6; 3 0.635,-2.6; 4 1.905,-2.6; 5 1.905,2.6; 6 0.635,2.6; 7 -0.635,2.6; 8 -1.905,2.6
SO18L = smd 0.66 x 2.032: 1 -0.635,-4.902; 2 0.635,-4.902; 3 1.905,-4.902; 4 3.175,-4.902; 5 4.445,-4.902; 6 5.715,-4.902; 7 6.985,-4.902; 8 8.255,-4.902; 9 9.525,-4.902; 10 9.525,4.902; 11 8.255,4.902; 12 6.985,4.902; 13 5.715,4.902; 14 4.445,4.902; 15 3.175,4.902; 16 1.905,4.902; 17 0.635,4.902; 18 -0.635,4.902

### Placement (x,y rotation side)
C1  71.88,11.18 270 top
C2  66.8,16.26 180 top
C3  66.8,20.32 180 top
C4  14.48,8.38 0 top
C5  66.8,24.38 180 top
C6  54.61,26.67 90 top
C7  23.11,29.97 90 top
C8  26.42,30.23 90 top
C9  57.66,40.89 0 top
C10  16.51,49.02 0 top
FID1  32,8.38 0 top
FID2  1.78,1.78 0 top
FID3  2.03,53.85 0 top
FID4  80.26,53.59 0 top
G1  0,0 0 top
ISSP  76.45,14.73 270 top
J1  12.45,4.32 180 top
J2  4.83,9.91 90 top
J3  4.83,21.59 90 top
J4  4.83,38.35 90 top
J5  4.83,52.07 0 top
JA  76.45,33.02 270 top
JP1  21.34,3.81 0 top
JP2  21.34,6.35 0 top
LED1  28.96,46.23 90 top
R1  62.23,9.14 90 top
R2  65.28,9.14 90 top
R3  70.1,14.22 180 top
R4  70.1,16.26 180 top
R5  70.1,18.29 180 top
R6  70.1,20.32 180 top
R7  70.1,22.35 180 top
R8  70.1,24.38 180 top
R9  13.97,30.99 0 top
R10  13.97,33.53 180 top
R11  19.05,33.53 180 top
R12  32,41.15 0 top
R13  32,43.69 0 top
R14  32,45.72 0 top
RS-485  80.01,43.94 270 top
RTERM  67.06,45.21 90 top
SJ1  38.1,8.89 90 top
SJ2  40.64,8.89 90 top
SJ3  48.26,8.89 270 top
SJ4  35.05,12.7 0 top
SJ5  18.54,30.99 180 top
TVS1  62.23,45.21 270 top
U1  16.51,25.91 270 top
U2  40.64,29.46 180 top
U3  56.13,45.21 270 top
U$1  55.37,13.72 0 top
U$9  [PA_LOGO_AGENT_LRG_SYM]  55.12,13.72 0 bottom
ULN1  16,11.43 90 top
ULN2  17.53,37.08 90 top

### Tracks (layer width: path | path; a pad name or v marks a point on that pad's centre or on a via)
3V3  (via drill 0.36)
  Top 0.61: SJ1.1 v38.1,6.1
  Bottom 1.016: G1.3V3 v38.1,6.1
5V0  (via drill 0.36)
  Top 0.61: SJ2.1 v40.64,6.1
  Top 1.016: v40.64,6.1 40.64,1.02 81.53,1.02 81.53,37.59 71.37,37.59 71.37,34.04 v68.83,34.04
  Bottom 1.016: G1.5V0@0 v40.64,6.1
  Bottom 1.27: G1.5V0@1 68.71,33.91 v68.83,34.04
12V0  (via drill 0.36)
  Top 0.203: 15.49,48.77 C10.1
  Top 0.61: SJ3.1 50.8,9.34 v50.8,7.87 | C10.1 15.49,48.86 v15.49,46.48 15.37,46.61 ULN2.10 | ULN1.10 13.33,20.95 13.46,21.08 | C4.1 13.63,18.63 v13.46,18.8
  Top 1.422: U1.3 13.46,23.6 13.46,21.08 v13.46,18.8
  Bottom 0.61: v13.46,18.8 13.21,18.8
  Bottom 1.016: v15.49,46.48 15.49,38.35 J4.1 | 50.8,1.27 v50.8,7.87 | J1.1 12.45,1.27
  Bottom 1.27: 2.03,21.59 J3.1 13.46,21.59 | 2.03,21.59 2.03,9.91 | 2.03,9.91 2.03,1.27 12.45,1.27 50.8,1.27 81.53,1.27 81.53,33.02 JA.1 | J2.1 2.03,9.91 | J4.1 2.03,38.35 | 2.03,38.35 2.03,21.59 | J5.1 2.03,52.07 2.03,38.35
  Bottom 1.422: 13.46,21.59 v13.46,18.8
A  (via drill 0.36)
  Top 0.61: U3.6 61.3,44.58 TVS1.2 61.3,43.43 67.06,43.43 | RTERM.1 67.06,43.43 | v69.6,43.94 69.6,43.43 67.06,43.43
  Bottom 1.27: RS-485.2 v69.6,43.94
ACNTL  (via drill 0.36)
  Top 0.305: R3.1 R4.1 73.91,16.26 74.17,16.51 v74.17,25.4
  Bottom 0.61: JA.4 v74.17,25.4
B  (via drill 0.36)
  Top 0.61: U3.7 61.3,45.85 TVS1.1 61.3,46.99 67.06,46.99 | RTERM.2 67.06,46.99 | v69.6,46.48 69.6,46.99 67.06,46.99
  Bottom 1.27: RS-485.1 v69.6,46.48
BCNTL  (via drill 0.36)
  Top 0.305: v74.17,27.94 74.17,27.69 72.39,27.69 72.39,20.32 R6.1 R5.1
  Bottom 0.61: JA.3 v74.17,27.94
CCNTL  (via drill 0.36)
  Top 0.305: 71.12,24.13 71.12,22.52 R7.1 | v74.17,30.48 70.95,30.48 R8.1
  Top 0.61: R8.1 71.12,24.13
  Bottom 0.61: JA.2 v74.17,30.48
DRN0  (via drill 0.36)
  Top 0.203: ULN2.11 12.7,45.47 12.7,45.21
  Top 0.61: 12.95,45.21 12.7,45.21 11.68,45.21 10.92,45.97 10.92,48.26 v12.45,49.78
  Bottom 0.61: J5.4 v12.45,49.78
DRN1  (via drill 0.36)
  Top 0.203: ULN2.12 12.7,44.2 12.7,43.94
  Top 0.61: 12.7,43.94 11.43,43.94 9.91,45.47 v9.91,49.78
  Bottom 0.61: J5.3 v9.91,49.78
DRN2  (via drill 0.36)
  Top 0.61: v7.37,49.78 7.37,48.01 8.89,46.48 8.89,45.21 11.3,42.8 ULN2.13
  Bottom 0.61: J5.2 v7.37,49.78
DRN3  (via drill 0.36)
  Top 0.203: ULN2.14 12.45,41.4 12.19,41.4
  Top 0.61: v7.11,45.97 7.87,45.21 7.87,44.7 9.65,42.93 9.65,41.66 9.91,41.4 12.19,41.4
  Bottom 0.61: J4.4 v7.11,45.97
DRN4  (via drill 0.36)
  Top 0.61: ULN2.15 9.27,40.26 8.64,40.89 8.64,41.91 v7.11,43.43
  Bottom 0.61: J4.3 v7.11,43.43
DRN5  (via drill 0.36)
  Top 0.61: v7.11,40.89 7.11,39.62 7.75,38.99 ULN2.16
  Bottom 0.61: J4.2 v7.11,40.89
DRN6  (via drill 0.36)
  Top 0.61: v7.11,31.75 8.38,31.75 9.91,33.27 9.91,36.32 11.3,37.72 ULN2.17
  Bottom 0.61: J3.5 v7.11,31.75
DRN7  (via drill 0.36)
  Top 0.61: v7.11,29.21 9.14,29.21 11.43,31.5 11.43,35.26 ULN2.18
  Bottom 0.61: J3.4 v7.11,29.21
DRN8  (via drill 0.36)
  Top 0.61: v7.11,26.67 7.62,26.67 8.89,25.4 8.89,19.81 9.02,19.68 ULN1.11
  Bottom 0.61: J3.3 v7.11,26.67
DRN9  (via drill 0.36)
  Top 0.61: v7.11,24.13 7.11,19.81 8.51,18.41 ULN1.12
  Bottom 0.61: J3.2 v7.11,24.13
DRN10  (via drill 0.36)
  Top 0.61: ULN1.13 7.49,17.14 v7.11,17.53
  Bottom 0.61: J2.4 v7.11,17.53
DRN11  (via drill 0.36)
  Top 0.61: ULN1.14 8,15.88 v7.11,14.99
  Bottom 0.61: J2.3 v7.11,14.99
DRN12  (via drill 0.36)
  Top 0.61: ULN1.15 8.76,14.61 7.62,13.46 7.62,12.95 v7.11,12.45
  Bottom 0.61: J2.2 v7.11,12.45
DRN13  (via drill 0.36)
  Top 0.61: ULN1.16 8.76,13.34 8.64,13.21 8.64,12.19 7.11,10.67 7.11,8.89 v4.83,6.6
  Bottom 0.61: J1.4 v4.83,6.6
DRN14  (via drill 0.36)
  Top 0.61: v7.37,6.6 7.37,7.37 8.38,8.38 8.38,10.41 9.65,11.68 9.65,11.94 9.78,12.06 ULN1.17
  Bottom 0.61: J1.3 v7.37,6.6
DRN15  (via drill 0.36)
  Top 0.61: ULN1.18 11.1,9.07 9.91,7.87 v9.91,6.6
  Bottom 0.61: J1.2 v9.91,6.6
GND  (via drill 0.36)
  Top 0.203: 47.75,19.56 47.75,19.48 | 65.83,20.07 65.79,20.07 C3.2 66.04,20.32 66.08,20.44 | 55.12,19.3 55.12,19.38 | 67.31,21.59 67.31,21.49 | 70.1,21.59 70.1,21.54 | 62.48,19.3 62.48,19.38 | 50.04,19.56 50.04,19.48 | 64.77,19.3 64.77,19.38
  Top 0.305: U2.17 v40.64,33.02 | TVS1.3 v64.52,45.21 | C1.2 72.05,10.16 72.14,10.16 v74.17,12.19 | C5.2 v64.26,24.38 | C3.2 v64.26,20.32 | C2.2 v64.26,16.26
  Top 0.61: R11.1 19.9,31.47 | 19.9,31.47 19.9,31.33 19.56,30.99 SJ5.1 | C7.- 19.9,31.47 | U3.5 59.18,43.31 59.18,40.89 | C9.2 59.18,40.89 | 59.18,40.89 60.71,40.89 v60.71,41.15 | ULN2.9 17.91,46.61 v17.78,46.48 17.78,48.6 C10.2 | C4.2 15.33,18.38 v15.75,18.8 17.91,20.95 ULN1.9
  Top 0.813: C7.- 26.42,31.47 C8.2 | C6.2 54.61,27.94 55.12,28.45 v55.12,33.02
  Top 1.422: v23.11,34.29 C7.-
  Bottom 0.203: 75.18,11.94 75.18,12.19 | 75.69,13.72 75.61,13.63 | v65.53,21.84 66.8,23.11 67.82,23.11 68.83,22.1 77.72,22.1 77.72,14.22 76.96,13.46 75.95,13.46
  Bottom 0.254: G1.GND@2 28.96,54.86 15.49,54.86 15.49,49.28 17.78,49.28 v17.78,46.48
  Bottom 0.305: v28.96,49.78 G1.GND@2
  Bottom 0.406: v64.26,16.26 v64.26,20.32 v64.26,24.38 70.61,24.38 70.87,24.13
  Bottom 0.61: v60.71,41.15 61.47,41.15 61.47,41.4 | 70.87,24.13 71.12,23.88 | G1.GND@1 G1.GND@0 42.93,3.81 42.93,8.89 28.45,8.89 28.45,3.81 JP1.3 JP1.2 JP1.1 18.8,3.81 18.8,18.8 v15.75,18.8
  Bottom 1.016: v17.78,46.48 17.78,34.29 | 17.78,34.29 9.4,34.29 | 9.4,34.29 v7.11,34.29 | v15.75,18.8 15.75,23.62 9.4,23.62 9.4,34.29 | 17.78,34.29 v23.11,34.29 | v40.64,33.02 23.11,33.02
  Bottom 1.27: 23.11,33.02 v23.11,34.29 | RS-485.3 71.12,41.4 | 71.12,41.4 64.52,41.4 | 64.52,41.4 v64.52,45.21 | v40.64,33.02 v55.12,33.02 60.71,33.02 v60.71,41.15 60.71,41.4 61.47,41.4 64.52,41.4 | G1.GND@3 71.12,26.67 | 71.12,26.67 71.12,41.4 | 71.12,26.67 71.12,23.88 71.12,22.86 JA.5 78.99,22.86 78.99,12.19 ISSP.2 75.18,12.19 v74.17,12.19
  Bottom 1.422: J3.6 v7.11,34.29
  pour Bottom (isolate 0.305): 1.02,0 0,1.02 0,54.86 1.02,55.88 81.53,55.88 82.55,54.86 82.55,1.02 81.53,0
  pour Top (isolate 0.305): 1.02,0 0,1.02 0,54.86 1.02,55.88 81.53,55.88 82.55,54.86 82.55,1.02 81.53,0
LED_D13
  Top 0.305: LED1.A 30.65,46.23 R14.1
N$1
  pour Top (isolate 0.305, rank 2): 17.53,28.96 17.53,22.86 21.34,22.86 21.34,28.96
P0_0
  Top 0.305: U2.35 37.44,18.14 34.54,15.24 34.54,12.76 SJ4.1
P0_1
  Top 0.305: R8.2 C5.1 66.13,22.86 64.52,22.86 61.72,20.07 44.96,20.07 43.84,21.18 U2.43
P0_2  (via drill 0.36)
  Top 0.305: U2.36 38.24,15.63 v37.34,14.73 | v44.2,14.48 44.45,14.48 45.21,13.72 51.82,13.72 55.63,9.91 55.63,8.89 55.88,8.64 58.42,8.64 v60.96,6.1
  Bottom 0.305: v37.34,14.73 43.94,14.73 v44.2,14.48
  Bottom 0.61: v60.96,6.1 G1.A3
P0_3  (via drill 0.36)
  Top 0.305: U2.42 43.04,13.6 43.69,12.95 51.31,12.95 54.86,9.4 54.86,8.13 55.37,7.62 57.91,7.62 58.42,7.11 v58.42,6.1
  Bottom 0.61: G1.A2 v58.42,6.1
P0_4  (via drill 0.36)
  Top 0.305: v53.34,6.1 53.34,8.38 50.29,11.43 42.42,11.43 41.66,12.19 39.62,12.19 39.04,12.78 39.04,12.95 | U2.37 39.04,12.95 | SJ4.2 38.79,12.7 39.04,12.95
  Bottom 0.61: G1.A0 v53.34,6.1
P0_5  (via drill 0.36)
  Top 0.305: v55.88,6.1 55.12,6.1 54.1,7.11 54.1,8.89 50.8,12.19 42.93,12.19 42.24,12.88 U2.41
  Bottom 0.61: G1.A1 v55.88,6.1
P0_6  (via drill 0.36)
  Top 0.305: v44.7,16.76 45.47,15.49 62.99,15.49 63.75,14.73 66.8,14.73 67.56,15.49 67.56,16.17 C2.1 R4.2 | U2.38 39.88,23.63 39.88,17.02 v40.13,16.76
  Bottom 0.305: v40.13,16.76 v44.7,16.76
P0_7  (via drill 0.36)
  Top 0.305: U2.40 41.44,19.34 v40.89,18.8 | v45.47,18.8 66.13,18.8 C3.1 | R6.2 C3.1 | C3.1 67.56,20.32
  Bottom 0.305: v40.89,18.8 v45.47,18.8
P1_0  (via drill 0.36)
  Top 0.305: v74.17,4.57 68.83,4.57 67.82,5.59 64.01,5.59 v63.5,6.1 62.23,7.37 R1.1 | v60.71,30.23 60.71,29.46 59.94,28.7 59.94,21.84 59.44,21.34 v57.91,21.34 | U2.18 39.84,33.49 39.37,33.02 39.37,31.24 v41.15,29.46
  Bottom 0.305: v41.15,29.46 59.94,29.46 v60.71,30.23 | v57.91,21.34 57.91,11.68 v63.5,6.1
  Bottom 0.61: G1.A4 v63.5,6.1 | ISSP.5 v74.17,4.57
P1_1  (via drill 0.36)
  Top 0.305: v74.17,7.11 73.15,6.1 68.58,6.1 68.07,6.6 66.29,6.6 v66.04,6.86 65.28,7.62 R2.1 | U2.16 41.44,34 42.16,33.27 42.16,32 v42.67,31.5 | v58.93,31.5 v58.93,23.11
  Bottom 0.203: 65.79,6.86 v66.04,6.86
  Bottom 0.305: v42.67,31.5 v58.93,31.5 | v58.93,23.11 58.93,13.97 v66.04,6.86
  Bottom 0.61: G1.A5 v66.04,6.86 | ISSP.4 v74.17,7.11
P1_2
  Top 0.305: U2.19 39.04,37.41 36.83,39.62 30.23,39.62 24.51,45.34 ULN2.8
P1_3  (via drill 0.36)
  Top 0.305: U2.15 42.24,37.01 38.35,40.89 38.35,42.42 36.07,44.7 36.07,45.97 34.8,47.24 31.5,47.24 | 31.5,47.24 28.45,47.24 28.19,46.99 LED1.C | v31.5,49.78 31.5,47.24
  Bottom 0.305: G1.13 v31.5,49.78
P1_4
  Top 0.305: U2.20 38.24,37.2 36.58,38.86 29.72,38.86 24.51,44.07 ULN2.7
P1_5  (via drill 0.36)
  Top 0.305: U2.14 43.04,37.48 39.62,40.89 39.62,44.2 v37.34,46.48 | R13.1 v29.46,43.69 28.7,43.69 25.4,46.99 25.4,49.02 24.89,49.53 24.13,49.53 v23.88,49.78
  Bottom 0.305: v37.34,46.48 36.32,47.5 30.23,47.5 29.46,46.74 v29.46,43.69
  Bottom 0.61: G1.SDA1 v23.88,49.78
P1_6
  Top 0.305: U2.21 37.44,36.73 36.07,38.1 29.21,38.1 24.51,42.8 ULN2.6
P1_7  (via drill 0.36)
  Top 0.305: U2.13 43.84,39.47 v41.15,42.16 | v36.58,42.16 31.24,42.16 30.99,41.91 30.99,41.31 R12.1 30.23,41.15 24.64,46.74 24.64,48.51 24.38,48.77 22.35,48.77 v21.34,49.78
  Bottom 0.305: v41.15,42.16 v36.58,42.16
  Bottom 0.61: G1.SCL1 v21.34,49.78
P2_0
  Top 0.305: U2.31 30.37,27.06 30.23,26.92 30.23,25.65 24.89,20.32 24.89,17.53 23.24,15.88 ULN1.5
P2_1  (via drill 0.36)
  Top 0.305: U2.3 50.94,27.06 53.34,29.46 53.34,38.61 v53.85,39.12 | v49.53,39.88 46.48,42.93 43.94,42.93 37.85,49.02 36.83,49.02 36.58,49.28 v36.58,49.78
  Bottom 0.305: v53.85,39.12 50.29,39.12 v49.53,39.88 | G1.11 v36.58,49.78
P2_2
  Top 0.305: U2.32 31.09,26.26 31.09,25.5 25.65,20.07 25.65,17.27 22.99,14.61 ULN1.4
P2_3  (via drill 0.36)
  Top 0.203: U2.2 46.48,26.16 46.54,26.16
  Top 0.305: 46.54,26.16 48.01,26.16 48.26,25.91 v48.26,24.13 | ULN1.1 22.99,10.79 27.43,15.24 27.43,16 32.26,20.83 v32.26,22.1
  Bottom 0.305: v32.26,22.1 47.24,22.1 48.26,23.11 v48.26,24.13
P2_4
  Top 0.305: U2.33 34.78,25.4 31.75,25.4 31.75,24.89 26.42,19.56 26.42,16.76 22.99,13.34 ULN1.3
P2_5  (via drill 0.36)
  Top 0.305: v46.23,24.13 46.99,24.89 46.99,25.4 46.5,25.4 U2.1 | ULN1.2 22.73,12.06 27.18,16.51 27.18,19.05 32.26,24.13 v33.27,24.13
  Bottom 0.305: v33.27,24.13 v46.23,24.13
P2_6  (via drill 0.36)
  Top 0.305: v26.42,8.64 26.42,9.91 35.05,18.54 35.05,22.08 U2.34 36.6,23.62
  Bottom 0.305: JP2.3 v26.42,8.64
P2_7  (via drill 0.36)
  Top 0.305: U2.44 44.64,22.92 45.47,22.1 48.51,22.1 51.05,24.64 51.05,25.91 54.1,28.96 54.1,37.85 55.37,39.12 55.37,40.39 v54.61,41.15 | v49.28,42.42 47.75,43.94 44.2,43.94 39.12,49.02 v39.12,49.78
  Bottom 0.305: v54.61,41.15 50.55,41.15 v49.28,42.42 | G1.10 v39.12,49.78
P3_0
  Top 0.305: U2.22 36.64,36.51 35.81,37.34 28.96,37.34 24.77,41.53 ULN2.5
P3_1  (via drill 0.36)
  Top 0.305: v66.04,49.78 66.04,49.28 65.53,48.77 44.96,48.77 v44.7,48.51 | v44.7,40.13 44.7,35.33 U2.12
  Bottom 0.305: G1.0 v66.04,49.78 | v44.7,48.51 v44.7,40.13
P3_2  (via drill 0.36)
  Top 0.305: U2.23 37.15,33.46 38.1,32.51 v38.1,31.75 | v25.4,27.18 24.89,26.67 24.89,25.65 v22.86,23.62 | v21.34,8.64 21.84,8.64 v28.7,15.49
  Bottom 0.305: JP2.1 v21.34,8.64 | v25.4,27.18 33.53,27.18 v38.1,31.75 | v28.7,15.49 28.7,23.62 v22.86,23.62
P3_3  (via drill 0.36)
  Top 0.203: 22.61,38.86 ULN2.3
  Top 0.305: v46.48,35.31 46.48,33.51 U2.11 | 22.35,38.86 22.61,38.86 24.64,38.86 28.96,34.54 32.26,34.54 v32.77,35.05
  Bottom 0.305: 34.54,34.54 34.8,34.54 | 34.8,34.54 45.72,34.54 v46.48,35.31 | v32.77,35.05 34.29,35.05 34.8,34.54
P3_4  (via drill 0.36)
  Top 0.305: v23.88,8.64 23.88,8.89 33.78,18.8 33.78,22.61 38.86,27.69 38.86,29.21 36.83,31.24 36.83,31.75 35.92,32.66 U2.24
  Bottom 0.305: JP2.2 v23.88,8.64
P3_5  (via drill 0.36)
  Top 0.305: v48.51,35.31 48.51,33.27 47.9,32.66 U2.10 | ULN2.4 25.02,40.26 v29.46,35.81
  Bottom 0.305: v48.51,35.31 47.5,36.58 31.75,36.58 30.99,35.81 v29.46,35.81
P3_6
  Top 0.305: U2.25 29.1,31.86 28.7,32.26 28.7,32.77 23.75,37.72 ULN2.2
P3_7  (via drill 0.36)
  Top 0.305: v46.23,49.78 v63.5,49.78 | U2.9 48.88,31.86 49.53,32.51 49.53,36.83 47.5,38.86 v46.23,38.86
  Bottom 0.305: v46.23,38.86 v46.23,49.78 | G1.1 v63.5,49.78
P4_0
  Top 0.305: U2.27 28.66,30.26 27.94,30.99 27.94,32.51 24,36.45 ULN2.1
P4_1  (via drill 0.36)
  Top 0.305: U2.7 49.31,30.26 50.29,31.24 50.29,37.59 46.23,41.66 43.94,41.66 37.59,48.01 35.05,48.01 34.04,49.02 v34.04,49.78
  Bottom 0.305: G1.12 v34.04,49.78
P4_2
  Top 0.305: U2.28 28.45,29.46 27.94,28.96 27.94,26.42 22.61,21.08 22.61,20.07 22.35,19.81 21.03,19.81 ULN1.8
P4_3
  Top 0.305: U2.6 49.53,29.46 51.05,30.99 51.05,46.48 51.82,47.24 53.41,47.24 U3.1
P4_4
  Top 0.305: U2.29 28.92,28.66 28.7,28.45 28.7,26.16 23.37,20.83 23.37,19.3 22.61,18.54 21.03,18.54 ULN1.7
P4_5
  Top 0.305: U3.2 U3.3 52.2,44.58 51.82,44.2 51.82,30.48 50,28.66 U2.5
P4_6
  Top 0.305: U2.30 29.64,27.86 29.46,27.69 29.46,25.91 24.13,20.57 24.13,18.03 23.37,17.27 21.03,17.27 ULN1.6
P4_7
  Top 0.305: U2.4 50.47,27.86 52.58,29.97 52.58,42.35 U3.4
V3_5
  Top 0.61: SJ5.2 18.09,33.42
  Top 0.813: R10.1 R11.2 18.09,33.42
VADJ
  Top 0.813: R10.2 R9.1 13.12,28.51 U1.1
VCC  (via drill 0.36)
  Top 0.305: U2.39 v40.64,25.91 | R2.2 R1.2 62.23,11.43 63.25,12.45 69.34,12.45 | C1.1 71.88,12.45 | 71.88,12.45 v74.17,14.73 | 71.88,12.45 69.34,12.45 | R3.2 69.25,12.53 69.34,12.45
  Top 0.406: R7.2 v67.31,22.35 | R5.2 v67.31,18.29
  Top 0.61: SJ1.2 SJ2.2 v40.64,10.92 | U3.8 56.64,47.12 56.64,46.99 | v34.54,41.15 R12.2 | R13.2 v34.54,43.69 | R14.2 v34.54,45.72
  Top 0.813: R9.2 15.49,30.99 16,30.48 v16,25.91 | C7.+ 26.42,28.47 C8.1 | C6.1 56.55,25.82 v56.64,25.91
  Top 1.27: v56.64,25.91 v56.64,37.59 56.64,40.89 | C9.1 56.64,40.89 | 56.64,40.89 56.64,46.99 56.64,47.24
  Top 1.422: U1.2 v16,25.91 | v23.11,25.91 C7.+
  Bottom 0.406: v67.31,22.35 v67.31,18.29 67.31,14.99 67.56,14.73
  Bottom 0.61: v56.64,37.59 34.54,37.59 v34.54,41.15 v34.54,43.69 v34.54,45.72
  Bottom 1.016: v40.64,25.91 30.23,25.91 v23.11,25.91
  Bottom 1.27: v16,25.91 v23.11,25.91 | v40.64,25.91 v56.64,25.91 62.74,25.91 62.74,14.73 67.56,14.73 v74.17,14.73 ISSP.1 | v40.64,10.92 30.23,10.92 30.23,25.91
VIN  (via drill 0.36)
  Top 0.61: v48.26,6.1 SJ3.2
  Bottom 1.016: G1.VIN v48.26,6.1
XRES  (via drill 0.36)
  Top 0.305: U2.26 35.99,31.06 37.08,29.97 37.08,28.45 v37.59,27.94 | v61.98,27.94 61.98,21.84 v61.21,21.34
  Bottom 0.305: v74.17,9.65 73.15,9.65 69.6,13.21 62.23,13.21 61.21,14.22 v61.21,21.34 | v37.59,27.94 v61.98,27.94
  Bottom 0.61: ISSP.3 v74.17,9.65

### Text on the board
tPlace: PatternAgents | Bridger | Rev. 3.1.0 | RS-485 | B | A | GND | Analog / Control / Input | PSoC / Programmer | 1 | 2 | 3 | Config. / Jumpers
bPlace: PatternAgents | Bridger | Rev. 3.1.0 | PCA#310A2013 | PatternAgents.com